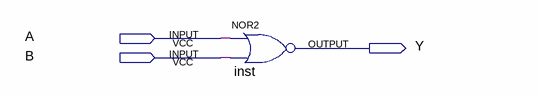
[diagram p0: schematic sheet]
// Quartus schematic hw_test.bdf as structural Verilog: 1 symbols, 3 pins
module hw_test (
  input  A,
  input  B,
  output Y
);

  nor inst (Y, A, B);
endmodule
